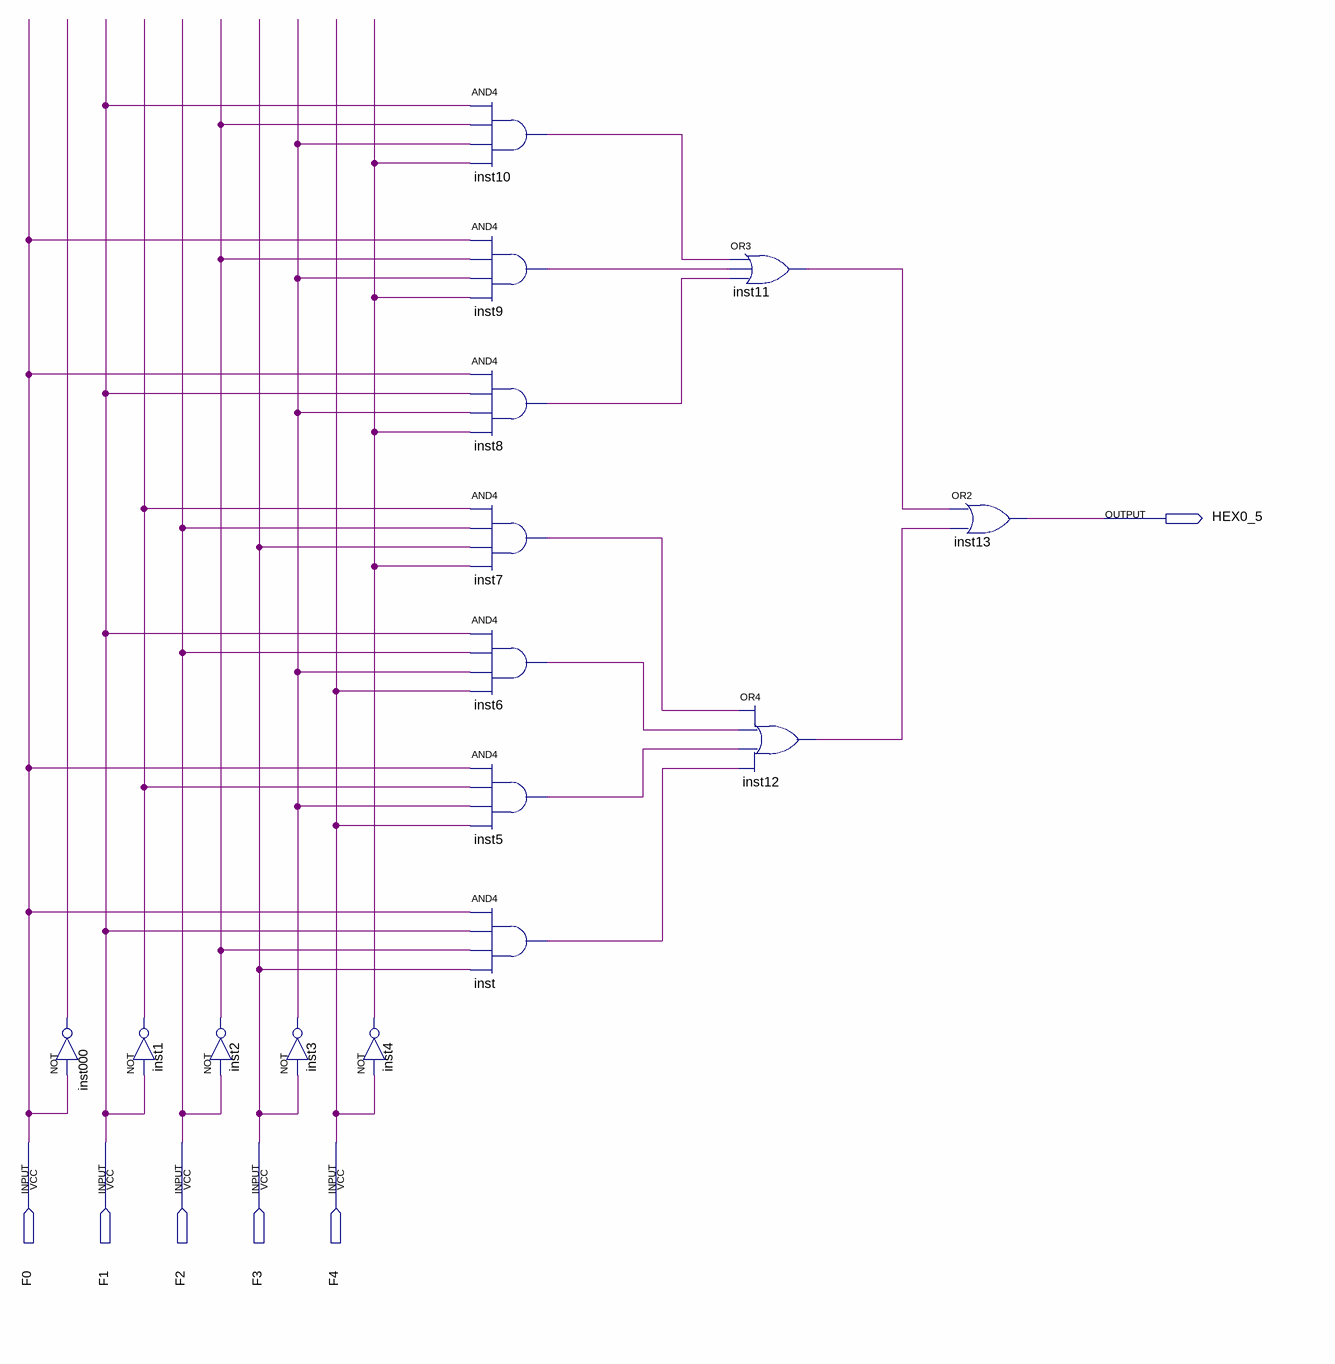
[diagram p0: schematic sheet]
// Quartus schematic HEX05.bdf as structural Verilog: 15 symbols, 6 pins
module HEX05 (
  input  F0,
  input  F1,
  input  F2,
  input  F3,
  input  F4,
  output HEX0_5
);

  wire inst000_out, inst1_out, inst2_out, inst3_out, inst4_out, inst5_out, inst6_out, inst7_out, inst8_out,
       inst9_out, inst10_out, inst11_out, inst12_out, inst_out;

  not inst000 (inst000_out, F0);
  not inst1 (inst1_out, F1);
  not inst2 (inst2_out, F2);
  not inst3 (inst3_out, F3);
  not inst4 (inst4_out, F4);
  and inst10 (inst10_out, F1, inst2_out, inst3_out, inst4_out);
  and inst9 (inst9_out, F0, inst2_out, inst3_out, inst4_out);
  and inst8 (inst8_out, F0, F1, inst3_out, inst4_out);
  and inst7 (inst7_out, inst1_out, F2, F3, inst4_out);
  and inst6 (inst6_out, F1, F2, inst3_out, F4);
  and inst5 (inst5_out, F0, inst1_out, inst3_out, F4);
  and inst (inst_out, F0, F1, inst2_out, F3);
  or inst11 (inst11_out, inst10_out, inst9_out, inst8_out);
  or inst12 (inst12_out, inst7_out, inst6_out, inst5_out, inst_out);
  or inst13 (HEX0_5, inst11_out, inst12_out);
endmodule
